# EAGLE schematic main (EAGLE 9.6.2)
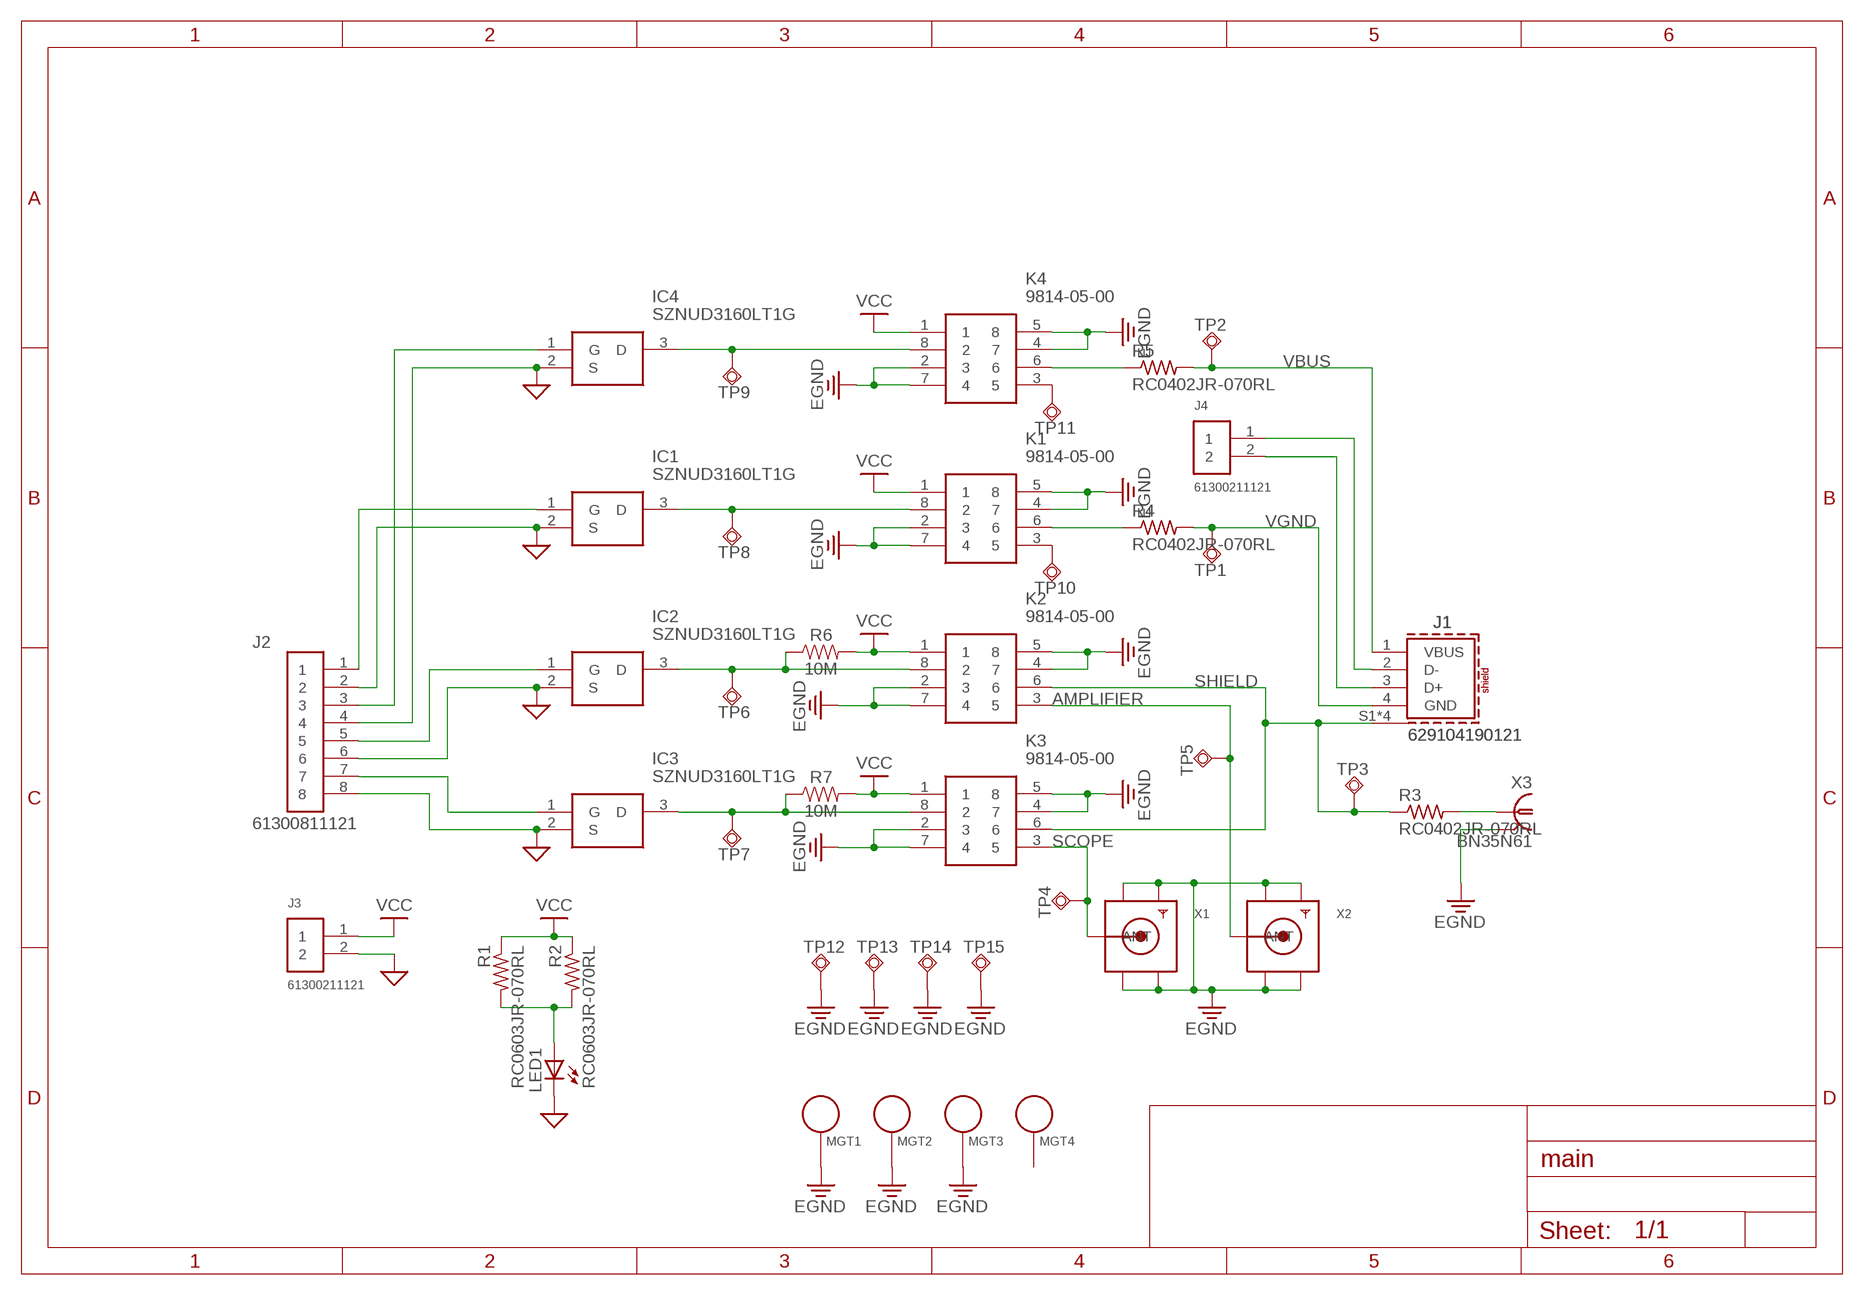
[diagram p0: schematic, sheet 1]

## Parts
IC1  SZNUD3160LT1G  [SOT96P237X111-3N]
IC2  SZNUD3160LT1G  [SOT96P237X111-3N]
IC3  SZNUD3160LT1G  [SOT96P237X111-3N]
IC4  SZNUD3160LT1G  [SOT96P237X111-3N]
J1  629104190121  [629104190121]
J2  61300811121  [61300811121]
J3  61300211121  [61300211121]
J4  61300211121  [61300211121]
K1  9814-05-00  [SOP102P1295X457-8N]
K2  9814-05-00  [SOP102P1295X457-8N]
K3  9814-05-00  [SOP102P1295X457-8N]
K4  9814-05-00  [SOP102P1295X457-8N]
LED1  LEDCHIPLED_0603  [CHIPLED_0603]
MGT1  BEAGLEBONEBLACK_MOUNTING_HOLE  [BEAGLEBONEBLACK_MOUNTING_HOLE]
MGT2  BEAGLEBONEBLACK_MOUNTING_HOLE  [BEAGLEBONEBLACK_MOUNTING_HOLE]
MGT3  BEAGLEBONEBLACK_MOUNTING_HOLE  [BEAGLEBONEBLACK_MOUNTING_HOLE]
MGT4  BEAGLEBONEBLACK_MOUNTING_HOLE  [BEAGLEBONEBLACK_MOUNTING_HOLE]
R1  RC0603JR-070RL  [RES_0603]
R2  RC0603JR-070RL  [RES_0603]
R3  RC0402JR-070RL  [RES_0402]
R4  RC0402JR-070RL  [RES_0402]
R5  RC0402JR-070RL  [RES_0402]
R6  10M  10MOHM-HORIZ-1/4W-5%  [AXIAL-0.3]
R7  10M  10MOHM-HORIZ-1/4W-5%  [AXIAL-0.3]
TP1  TESTPAD_TPSQPAD1-13  [TESTPAD_P1-13]
TP2  TESTPAD_TPSQPAD1-13  [TESTPAD_P1-13]
TP3  TESTPAD_TPSQPAD1-13  [TESTPAD_P1-13]
TP4  TESTPAD_TPSQPAD1-13  [TESTPAD_P1-13]
TP5  TESTPAD_TPSQPAD1-13  [TESTPAD_P1-13]
TP6  TESTPAD_TPSQTP07SQ  [TESTPAD_TP07SQ]
TP7  TESTPAD_TPSQTP07SQ  [TESTPAD_TP07SQ]
TP8  TESTPAD_TPSQTP07SQ  [TESTPAD_TP07SQ]
TP9  TESTPAD_TPSQTP07SQ  [TESTPAD_TP07SQ]
TP10  TESTPAD_TPSQPAD1-13  [TESTPAD_P1-13]
TP11  TESTPAD_TPSQPAD1-13  [TESTPAD_P1-13]
TP12  TESTPAD_TPSQPAD1-13  [TESTPAD_P1-13]
TP13  TESTPAD_TPSQPAD1-13  [TESTPAD_P1-13]
TP14  TESTPAD_TPSQPAD1-13  [TESTPAD_P1-13]
TP15  TESTPAD_TPSQPAD1-13  [TESTPAD_P1-13]
X1  SMACONNECTOR_EDGE  [SMA_EDGELAUNCH]
X2  SMACONNECTOR_EDGE  [SMA_EDGELAUNCH]
X3  BN35N61  [B35N61]

## Nets
AMPLIFIER: K2.3 TP5.TP X2.P(ANT)
EGND: K1.2 K1.4 K1.5 K1.7 K2.2 K2.4 K2.5 K2.7 K3.2 K3.4 K3.5 K3.7 K4.2 K4.4 K4.5 K4.7 MGT1.P$1 MGT2.P$1 MGT3.P$1 TP12.TP TP13.TP TP14.TP TP15.TP X1.GND@1(GND4) X1.GND@2(GND3) X1.GND@3(GND2) X1.GND@4(GND1) X2.GND@1(GND4) X2.GND@2(GND3) X2.GND@3(GND2) X2.GND@4(GND1) X3.2 X3.3 X3.4 X3.5
GND: IC1.2(S) IC2.2(S) IC3.2(S) IC4.2(S) J2.2 J2.4 J2.6 J2.8 J3.2 LED1.C ; supply symbol labelled SUP
N$1: K1.3 TP10.TP
N$2: K4.3 TP11.TP
N$4: IC3.3(D) K3.8 R7.P$1 TP7.TP
N$5: IC2.3(D) K2.8 R6.P$1 TP6.TP
N$6: IC3.1(G) J2.7
N$7: IC4.3(D) K4.8 TP9.TP
N$8: IC2.1(G) J2.5
N$9: IC1.3(D) K1.8 TP8.TP
N$10: IC1.1(G) J2.1
N$11: J1.3(D+) J4.2
N$12: IC4.1(G) J2.3
N$15: J1.2(D-) J4.1
N$16: LED1.A R1.2 R2.2
N$17: K1.6 R4.1
N$18: K4.6 R5.1
N$19: R3.2 X3.1
SCOPE: K3.3 TP4.TP X1.P(ANT)
SHIELD: J1.S1(SHIELD) J1.S2(SHIELD) J1.S3(SHIELD) J1.S4(SHIELD) K2.6 K3.6 R3.1 TP3.TP
VBUS: J1.1(VBUS) R5.2 TP2.TP
VCC: J3.1 K1.1 K2.1 K3.1 K4.1 R1.1 R2.1 R6.P$2 R7.P$2
VGND: J1.4(GND) R4.2 TP1.TP
Unconnected: MGT4.P$1

## Library data of the parts
IC1-IC4 = SamacSys_Parts:SZNUD3160LT1G: MOSFET Power Driver, 272mA, 3-pin SOT-23 Source: Datasheet <http://www.onsemi.com/pub/Collateral/NUD3160-D.PDF>; ARROW_PART_NUMBER: SZNUD3160LT1G; ARROW_PRICE-STOCK: https://www.arrow.com/en/products/sznud3160lt1g/on-semiconductor?region=nac; DESCRIPTION: MOSFET Power Driver, 272mA, 3-pin SOT-23; HEIGHT: 1.11mm; MANUFACTURER_NAME: ON Semiconductor; MANUFACTURER_PART_NUMBER: SZNUD3160LT1G; MOUSER_PART_NUMBER: 863-SZNUD3160LT1G; MOUSER_PRICE-STOCK: https://www.mouser.co.uk/ProductDetail/onsemi/SZNUD3160LT1G?qs=3PKVEWFFm2%252BNTcSrPn9lDQ%3D%3D
J1 = Wurth_Connectors_WR-USB:629104190121: WR-COM USB 2.0 Type A Horizontal SMT Short Type Kind Properties Durability:1500 Mating cycles Quality Class:1500 Mating cycles Connector Type:USB 2.0 Gender:Receptacle Type:Horizontal - Short Type General Information Operating Temperature:-40 up to +85 °C Compliance:RoHS Electrical Properties IR 1:1.5A Working Voltage:30V (AC) Withstanding Voltage:500 V (AC) Contact Resistance:30 mΩ Material Properties Insulator Material:LCP Insulator Flammability Rating:UL94 V-0 Color:Black Cover Material:Brass Cover Plating:Nickel Contact Material:Brass Contact Plating:Gold over Nickel Contact Type:Stamped Shielding Material:Brass Shielding Plating:Nickel <https://www.we-online.com/catalog/media/o85075v209%20Family_WR-COM_629104190121.jpg> Details see: https://www.we-online.com/catalog/en/COM_2_0_SMT_TYPE_A_HORIZONTAL_SHORT_TYPE/ Updated by Ella Wu 2020-08-05 2020 (C) Würth Elektronik; APPLICATION: USB 2.0; DATASHEET-URL: https://www.we-online.com/catalog/datasheet/629104190121.pdf; GERDER: Receptacle; INTERFACE-TYPE: Type A; IR1: 1.5A; MOUNT: SMT; PACKAGING: Tape and Reel & Mylar; PART-NUMBER: 629104190121; PINS: 4; TYPE: Horizontal - Short Type; WORKING-VOLTAGE: 30V(AC)
J2 = Headers:61300811121: CONN HEADER VERT 8POS 2.54MM Manufacturer's datasheet <https://katalog.we-online.de/em/datasheet/6130xx11121.pdf>; CREATED_BY: PCBLayout.com; DIGI_KEY_PART_NUMBER: 732-5321-ND; MANUFACTURER: Wurth Electronics Inc.; MPN: 61300811121
J3 J4 = Headers:61300211121: CONN HEADER VERT 2POS 2.54MM Manufacturer's datasheet <https://katalog.we-online.de/em/datasheet/6130xx11121.pdf>; CREATED_BY: PCBLayout.com; DIGI_KEY_PART_NUMBER: 732-5315-ND; MANUFACTURER: Wurth Electronics Inc.; MPN: 61300211121
K1-K4 = SamacSys_Parts:9814-05-00: COTO TECHNOLOGY - 9814-05-00 - RELAY, REED, SPST-NO, 100V, 0.25A, SMD Source: Datasheet <http://cotorelay.com/wp-content/uploads/2014/09/9814_series_reed_relay_datasheet.pdf>; DESCRIPTION: COTO TECHNOLOGY - 9814-05-00 - RELAY, REED, SPST-NO, 100V, 0.25A, SMD; HEIGHT: 4.57mm; MANUFACTURER_NAME: Coto Technology; MANUFACTURER_PART_NUMBER: 9814-05-00; MOUSER_PART_NUMBER: 816-9814-05-00; MOUSER_PRICE-STOCK: https://www.mouser.co.uk/ProductDetail/Coto-Technology/9814-05-00?qs=%252B2t8avA00rveEvUcfOyPJA%3D%3D
LED1 = adafruit:LED: LED OSRAM: - CHIPLED LG R971, LG N971, LY N971, LG Q971, LY Q971, LO R971, LY R971 LH N974, LH R974 LS Q976, LO Q976, LY Q976 LO Q996 - Hyper CHIPLED LW Q18S LB Q993, LB Q99A, LB R99A - SideLED LS A670, LO A670, LY A670, LG A670, LP A670 LB A673, LV A673, LT A673, LW A673 LH A674 LY A675 LS A676, LA A676, LO A676, LY A676, LW A676 LS A679, LY A679, LG A679 - Hyper Micro SIDELED® LS Y876, LA Y876, LO Y876, LY Y876 LT Y87S - SmartLED LW L88C, LW L88S LB L89C, LB L89S, LG L890 LS L89K, LO L89K, LY L89K LS L896, LA L896, LO L896, LY L896 - TOPLED LS T670, LO T670, LY T670, LG T670, LP T670 LSG T670, LSP T670, LSY T670, LOP T670, LYG T670 LG T671, LOG T671, LSG T671 LB T673, LV T673, LT T673, LW T673 LH T674 LS T676, LA T676, LO T676, LY T676, LB T676, LH T676, LSB T676, LW T676 LB T67C, LV T67C, LT T67C, LS T67K, LO T67K, LY T67K, LW E67C LS E67B, LA E67B, LO E67B, LY E67B, LB E67C, LV E67C, LT E67C LW T67C LS T679, LY T679, LG T679 LS T770, LO T770, LY T770, LG T770, LP T770 LB T773, LV T773, LT T773, LW T773 LH T774 LS E675, LA E675, LY E675, LS T675 LS T776, LA T776, LO T776, LY T776, LB T776 LHGB T686 LT T68C, LB T68C - Hyper Mini TOPLED® LB M676 - Mini TOPLED Santana® LG M470 LS M47K, LO M47K, LY M47K Source: http://www.osram.convergy.de/
MGT1-MGT4 = BeagleBone_Black_Wireless:BEAGLEBONEBLACK_MOUNTING_HOLE: Chassis Mounting Hole w/GND connection ability
R1 R2 = Resistor_Capacitor:RC0603JR-070RL: RES SMD 0 OHM JUMPER 1/10W 0603 Manufacturer's datasheet <http://www.yageo.com/documents/recent/PYu-RC_Group_51_RoHS_L_10.pdf>; CREATED_BY: PCBLayout.com; DIGIKEY_PART_NUMBER: 311-0.0GRTR-ND; MANUFACTURER: Yageo; MPN: RC0603JR-070RL; PACKAGE: SMD 0603
R3-R5 = Resistor_Capacitor:RC0402JR-070RL: RES SMD 0 OHM JUMPER 1/16W 0402 Manufacturer's datasheet <http://www.yageo.com/documents/recent/PYu-RC_Group_51_RoHS_L_10.pdf>; CREATED_BY: PCBLayout.com; DIGIKEY_PART_NUMBER: 311-0.0JRTR-ND; MANUFACTURER: Yageo; MPN: RC0402JR-070RL; PACKAGE: SMD 0402
R6 R7 = SparkFun-Resistors:10MOHM: RES-09327; PROD_ID: RES-09327
TP1-TP15 = BeagleBone_Blue_R3:TESTPAD_TPSQ: Test pad
X1 X2 = adafruit:SMACONNECTOR: SMA Connector 90° DIP SMA Connector, 50 Ohm (4UConnector: 07259)
X3 = con-coax:BN35N61: BNC CONNECTOR M/A COM www.macom.com distributor Farnell 149-452; OC_FARNELL: unknown; OC_NEWARK: unknown